# Altium schematic sheet Main.SchDoc
size Tabloid; SheetNumber: 1; SheetTotal: 1; Sheet_Name: Insert name in Document Parameters; Size: 11x17
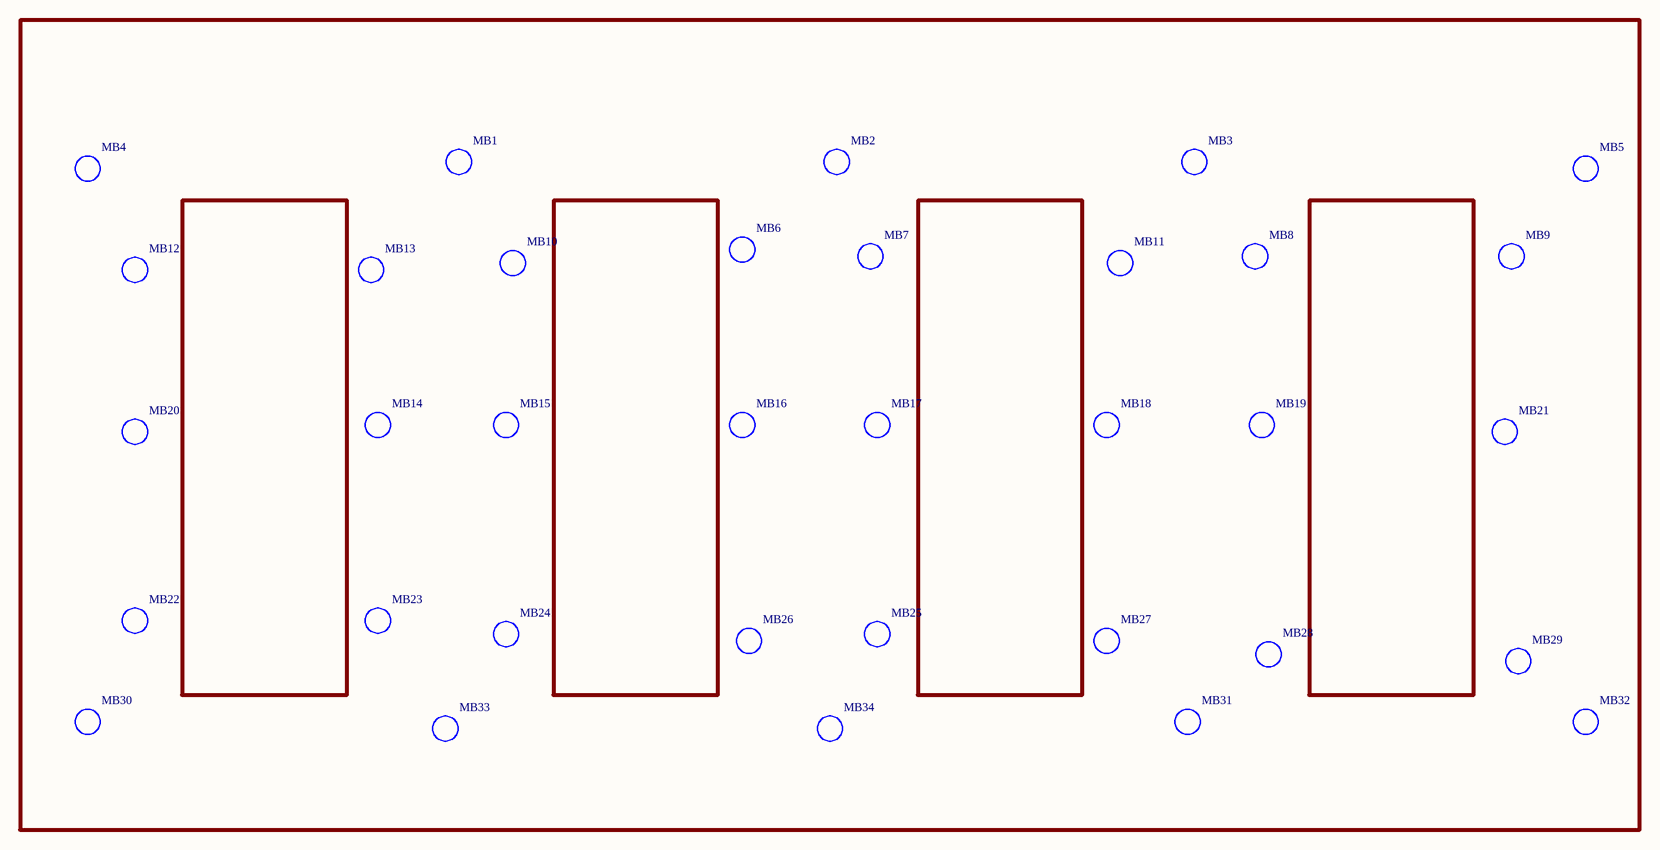
[diagram p0: Main.SchDoc]

## Parts
MB1  Part Number  [Mousebite]  (value not drawn)
MB2  Part Number  [Mousebite]  (value not drawn)
MB3  Part Number  [Mousebite]  (value not drawn)
MB4  Part Number  [Mousebite]  (value not drawn)
MB5  Part Number  [Mousebite]  (value not drawn)
MB6  Part Number  [Mousebite]  (value not drawn)
MB7  Part Number  [Mousebite]  (value not drawn)
MB8  Part Number  [Mousebite]  (value not drawn)
MB9  Part Number  [Mousebite]  (value not drawn)
MB10  Part Number  [Mousebite]  (value not drawn)
MB11  Part Number  [Mousebite]  (value not drawn)
MB12  Part Number  [Mousebite]  (value not drawn)
MB13  Part Number  [Mousebite]  (value not drawn)
MB14  Part Number  [Mousebite]  (value not drawn)
MB15  Part Number  [Mousebite]  (value not drawn)
MB16  Part Number  [Mousebite]  (value not drawn)
MB17  Part Number  [Mousebite]  (value not drawn)
MB18  Part Number  [Mousebite]  (value not drawn)
MB19  Part Number  [Mousebite]  (value not drawn)
MB20  Part Number  [Mousebite]  (value not drawn)
MB21  Part Number  [Mousebite]  (value not drawn)
MB22  Part Number  [Mousebite]  (value not drawn)
MB23  Part Number  [Mousebite]  (value not drawn)
MB24  Part Number  [Mousebite]  (value not drawn)
MB25  Part Number  [Mousebite]  (value not drawn)
MB26  Part Number  [Mousebite]  (value not drawn)
MB27  Part Number  [Mousebite]  (value not drawn)
MB28  Part Number  [Mousebite]  (value not drawn)
MB29  Part Number  [Mousebite]  (value not drawn)
MB30  Part Number  [Mousebite]  (value not drawn)
MB31  Part Number  [Mousebite]  (value not drawn)
MB32  Part Number  [Mousebite]  (value not drawn)
MB33  Part Number  [Mousebite]  (value not drawn)
MB34  Part Number  [Mousebite]  (value not drawn)

## Notes on the sheet
- Sheet Name
- Project Title
- Global Project
- Size
- Group
- Revision
- Date
- Sheet
- of
- Filename
- Designers

## Library data of the parts
MB1-MB34 = Mousebite: Mousebite, 0.5 mm hole 5x, 0.3 mm spacing, 1.5 mm tool route; GRAMS Lib Spec: 2.7